# EAGLE design tcam_mini_eth (EAGLE 7.7.0)

## Sheet 1 of 3
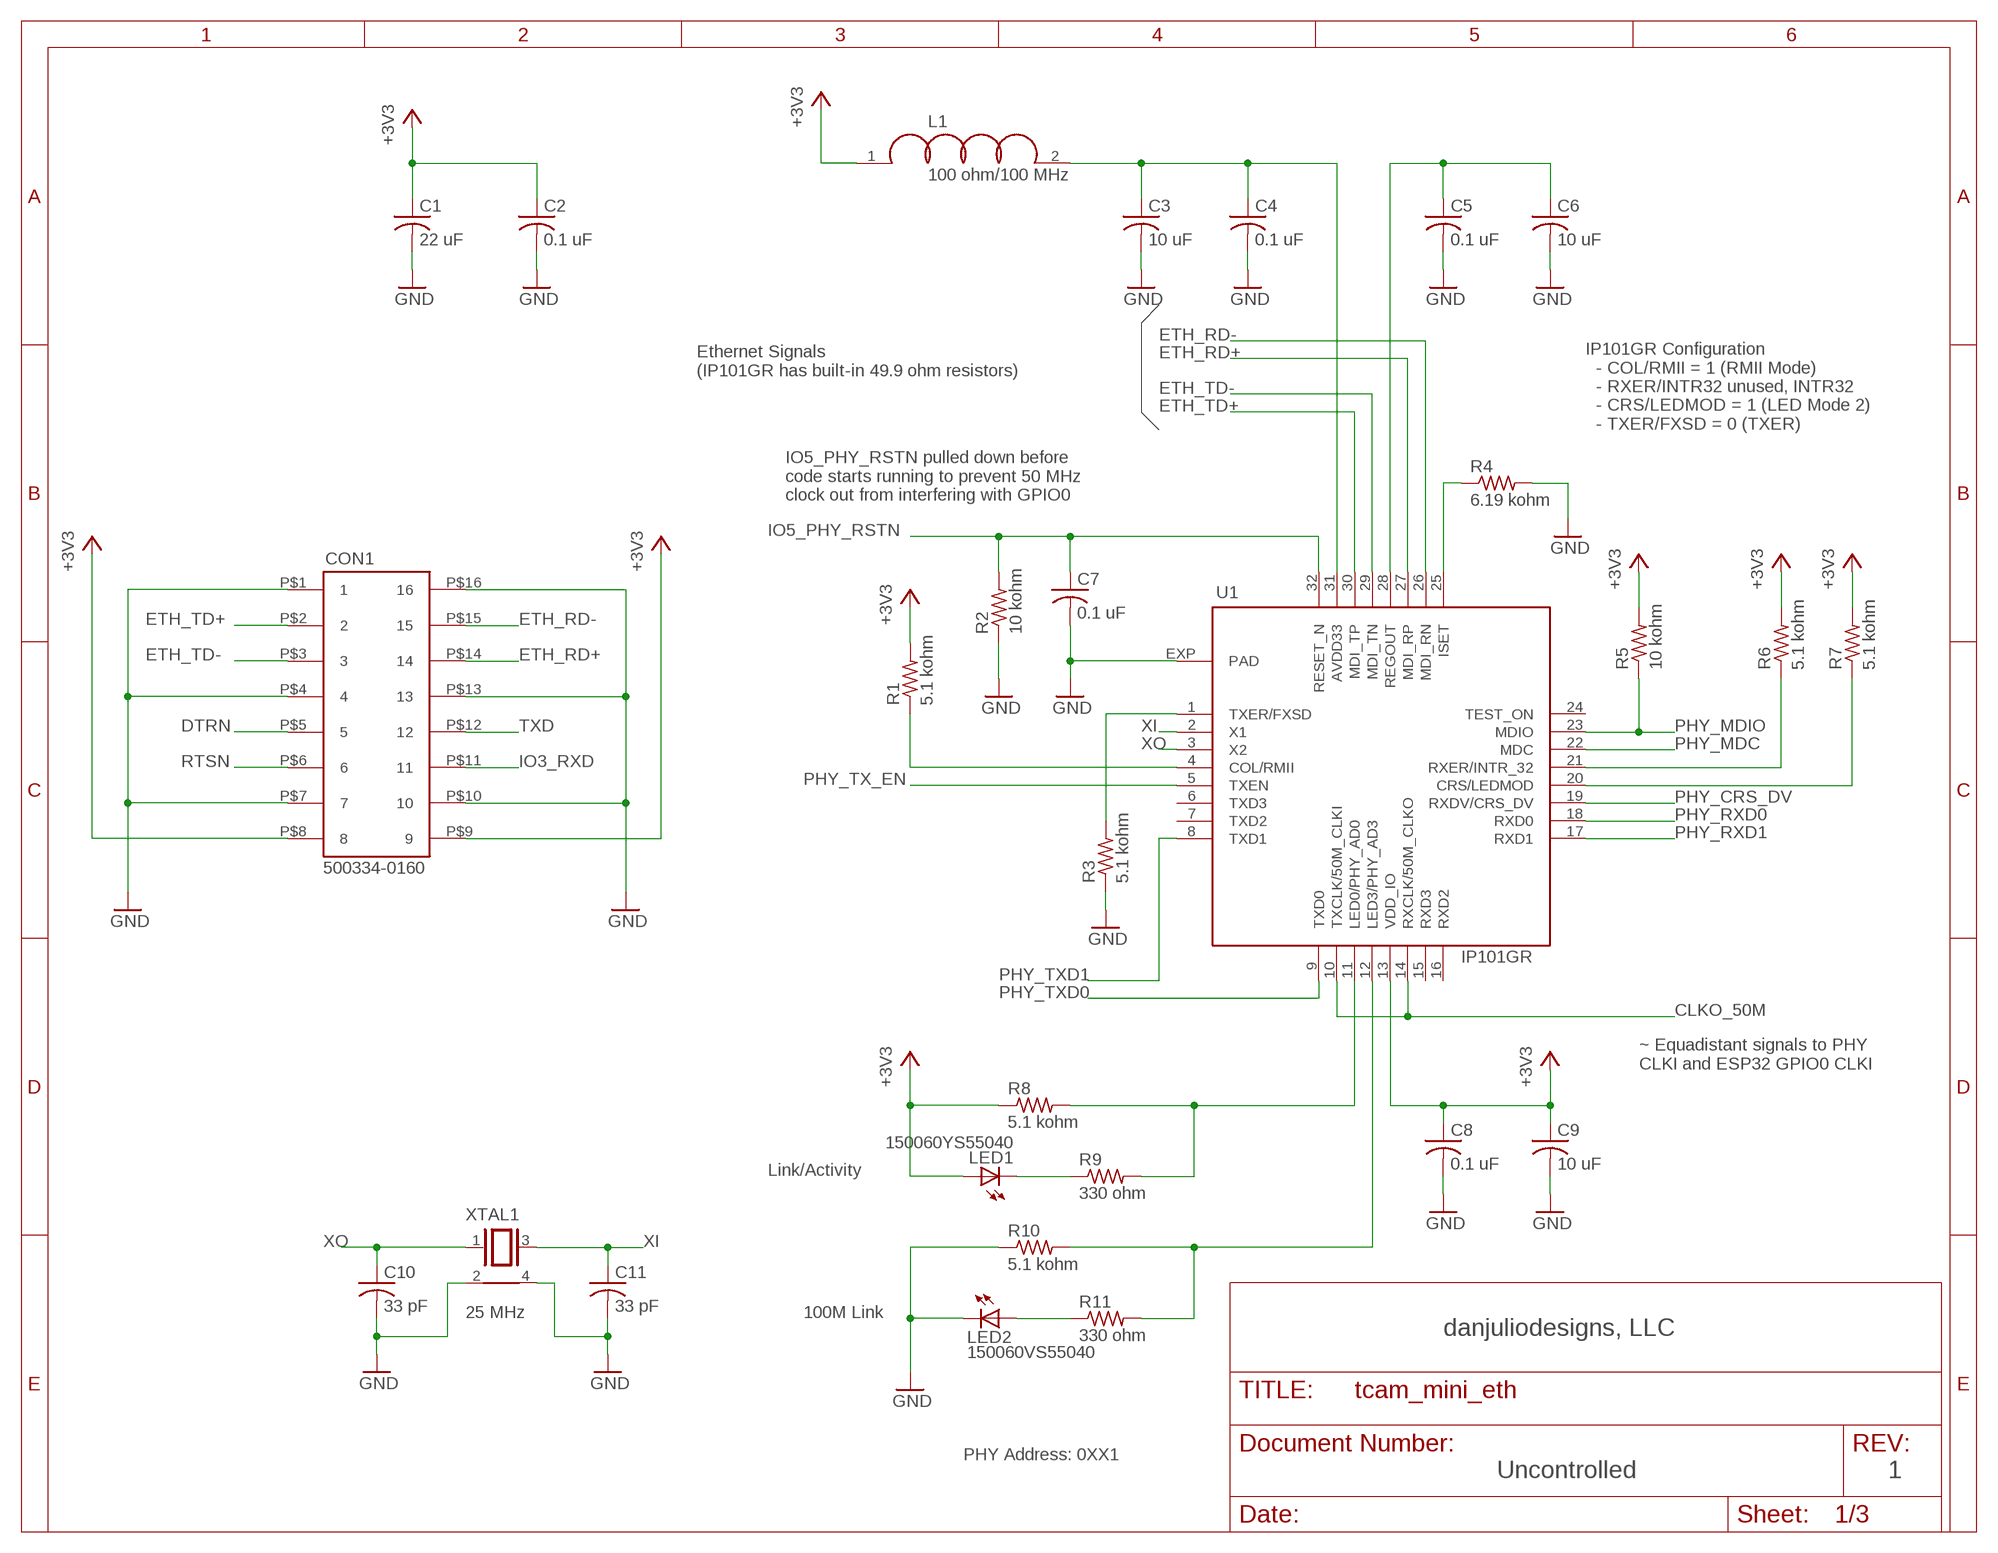
[diagram p0: schematic, sheet 1]

### Parts
C1  22 uF  C-USSMT0603  [C0603]
C2  0.1 uF  C-USSMT0402  [C0402]
C3  10 uF  C-USSMT0603  [C0603]
C4  0.1 uF  C-USSMT0402  [C0402]
C5  0.1 uF  C-USSMT0402  [C0402]
C6  10 uF  C-USSMT0603  [C0603]
C7  0.1 uF  C-USSMT0402  [C0402]
C8  0.1 uF  C-USSMT0402  [C0402]
C9  10 uF  C-USSMT0603  [C0603]
C10  33 pF  C-USSMT0402  [C0402]
C11  33 pF  C-USSMT0402  [C0402]
CON1  500334-0160  MOLEX_500334_160  [MOLEX_500334_0160]
L1  100 ohm/100 MHz  INDUCTORSMT0603  [L0603]
LED1  150060YS55040  LEDCHIPLED_0603  [CHIPLED_0603]
LED2  150060VS55040  LEDCHIPLED_0603  [CHIPLED_0603]
R1  5.1 kohm  R-USSMT0402  [R0402]
R2  10 kohm  R-USSMT0402  [R0402]
R3  5.1 kohm  R-USSMT0402  [R0402]
R4  6.19 kohm  R-USSMT0402  [R0402]
R5  10 kohm  R-USSMT0402  [R0402]
R6  5.1 kohm  R-USSMT0402  [R0402]
R7  5.1 kohm  R-USSMT0402  [R0402]
R8  5.1 kohm  R-USSMT0402  [R0402]
R9  330 ohm  R-USSMT0402  [R0402]
R10  5.1 kohm  R-USSMT0402  [R0402]
R11  330 ohm  R-USSMT0402  [R0402]
U1  IP101GR  [QFN32_4X4]
XTAL1  25 MHz  CRYSTAL5X3SMT3225  [CRYSTAL-3225]

### Nets
+3V3: C1.1 C2.1 C8.1 C9.1 CON1.P$8 CON1.P$9 L1.1 LED1.A R1.2 R5.2 R6.2 R7.2 R8.1 U1.13(VDD_IO) ; also sheet 2,3
CLKO_50M: U1.10(TXCLK/50M_CLKI) U1.14(RXCLK/50M_CLKO) ; also sheet 2
DTRN: CON1.P$5 ; also sheet 2
ETH_RD+: CON1.P$14 U1.27(MDI_RP)
ETH_RD-: CON1.P$15 U1.26(MDI_RN)
ETH_TD+: CON1.P$2 U1.30(MDI_TP)
ETH_TD-: CON1.P$3 U1.29(MDI_TN)
GND: C1.2 C2.2 C3.2 C4.2 C5.2 C6.2 C7.2 C8.2 C9.2 C10.2 C11.2 CON1.P$1 CON1.P$4 CON1.P$7 CON1.P$10 CON1.P$13 CON1.P$16 LED2.C R2.1 R3.1 R4.2 R10.1 U1.EXP(PAD) XTAL1.2 XTAL1.4 ; also sheet 2,3
IO3_RXD: CON1.P$11 ; also sheet 2
IO5_PHY_RSTN: C7.1 R2.2 U1.32(RESET_N) ; also sheet 2
N$1: C3.1 C4.1 L1.2 U1.31(AVDD33)
N$2: R4.1 U1.25(ISET)
N$3: R6.1 U1.21(RXER/INTR_32)
N$4: R1.1 U1.4(COL/RMII)
N$5: R3.2 U1.1(TXER/FXSD)
N$6: R7.1 U1.20(CRS/LEDMOD)
N$7: R8.2 R9.2 U1.11(LED0/PHY_AD0)
N$8: R10.2 R11.2 U1.12(LED3/PHY_AD3)
N$9: LED2.A R11.1
N$10: LED1.C R9.1
PHY_CRS_DV: U1.19(RXDV/CRS_DV) ; also sheet 2
PHY_MDC: U1.22(MDC) ; also sheet 2
PHY_MDIO: R5.1 U1.23(MDIO) ; also sheet 2
PHY_RXD0: U1.18(RXD0) ; also sheet 2
PHY_RXD1: U1.17(RXD1) ; also sheet 2
PHY_TX_EN: U1.5(TXEN) ; also sheet 2
PHY_TXD0: U1.9(TXD0) ; also sheet 2
PHY_TXD1: U1.8(TXD1) ; also sheet 2
REGOUT: C5.1 C6.1 U1.28(REGOUT)
RTSN: CON1.P$6 ; also sheet 2
TXD: CON1.P$12 ; also sheet 2
XI: C11.1 U1.2(X1) XTAL1.3
XO: C10.1 U1.3(X2) XTAL1.1
Unconnected: U1.6(TXD3) U1.7(TXD2) U1.15(RXD3) U1.16(RXD2) U1.24(TEST_ON)

### Notes on the sheet
- Ethernet Signals
  (IP101GR has built-in 49.9 ohm resistors)
- IP101GR Configuration
    - COL/RMII = 1 (RMII Mode)
    - RXER/INTR32 unused, INTR32
    - CRS/LEDMOD = 1 (LED Mode 2)
    - TXER/FXSD = 0 (TXER)
- IO5_PHY_RSTN pulled down before
  code starts running to prevent 50 MHz
  clock out from interfering with GPIO0
- ~ Equadistant signals to PHY
  CLKI and ESP32 GPIO0 CLKI
- Link/Activity
- 100M Link
- danjuliodesigns, LLC
- PHY Address: 0XX1
- Uncontrolled | 1

## Sheet 2 of 3
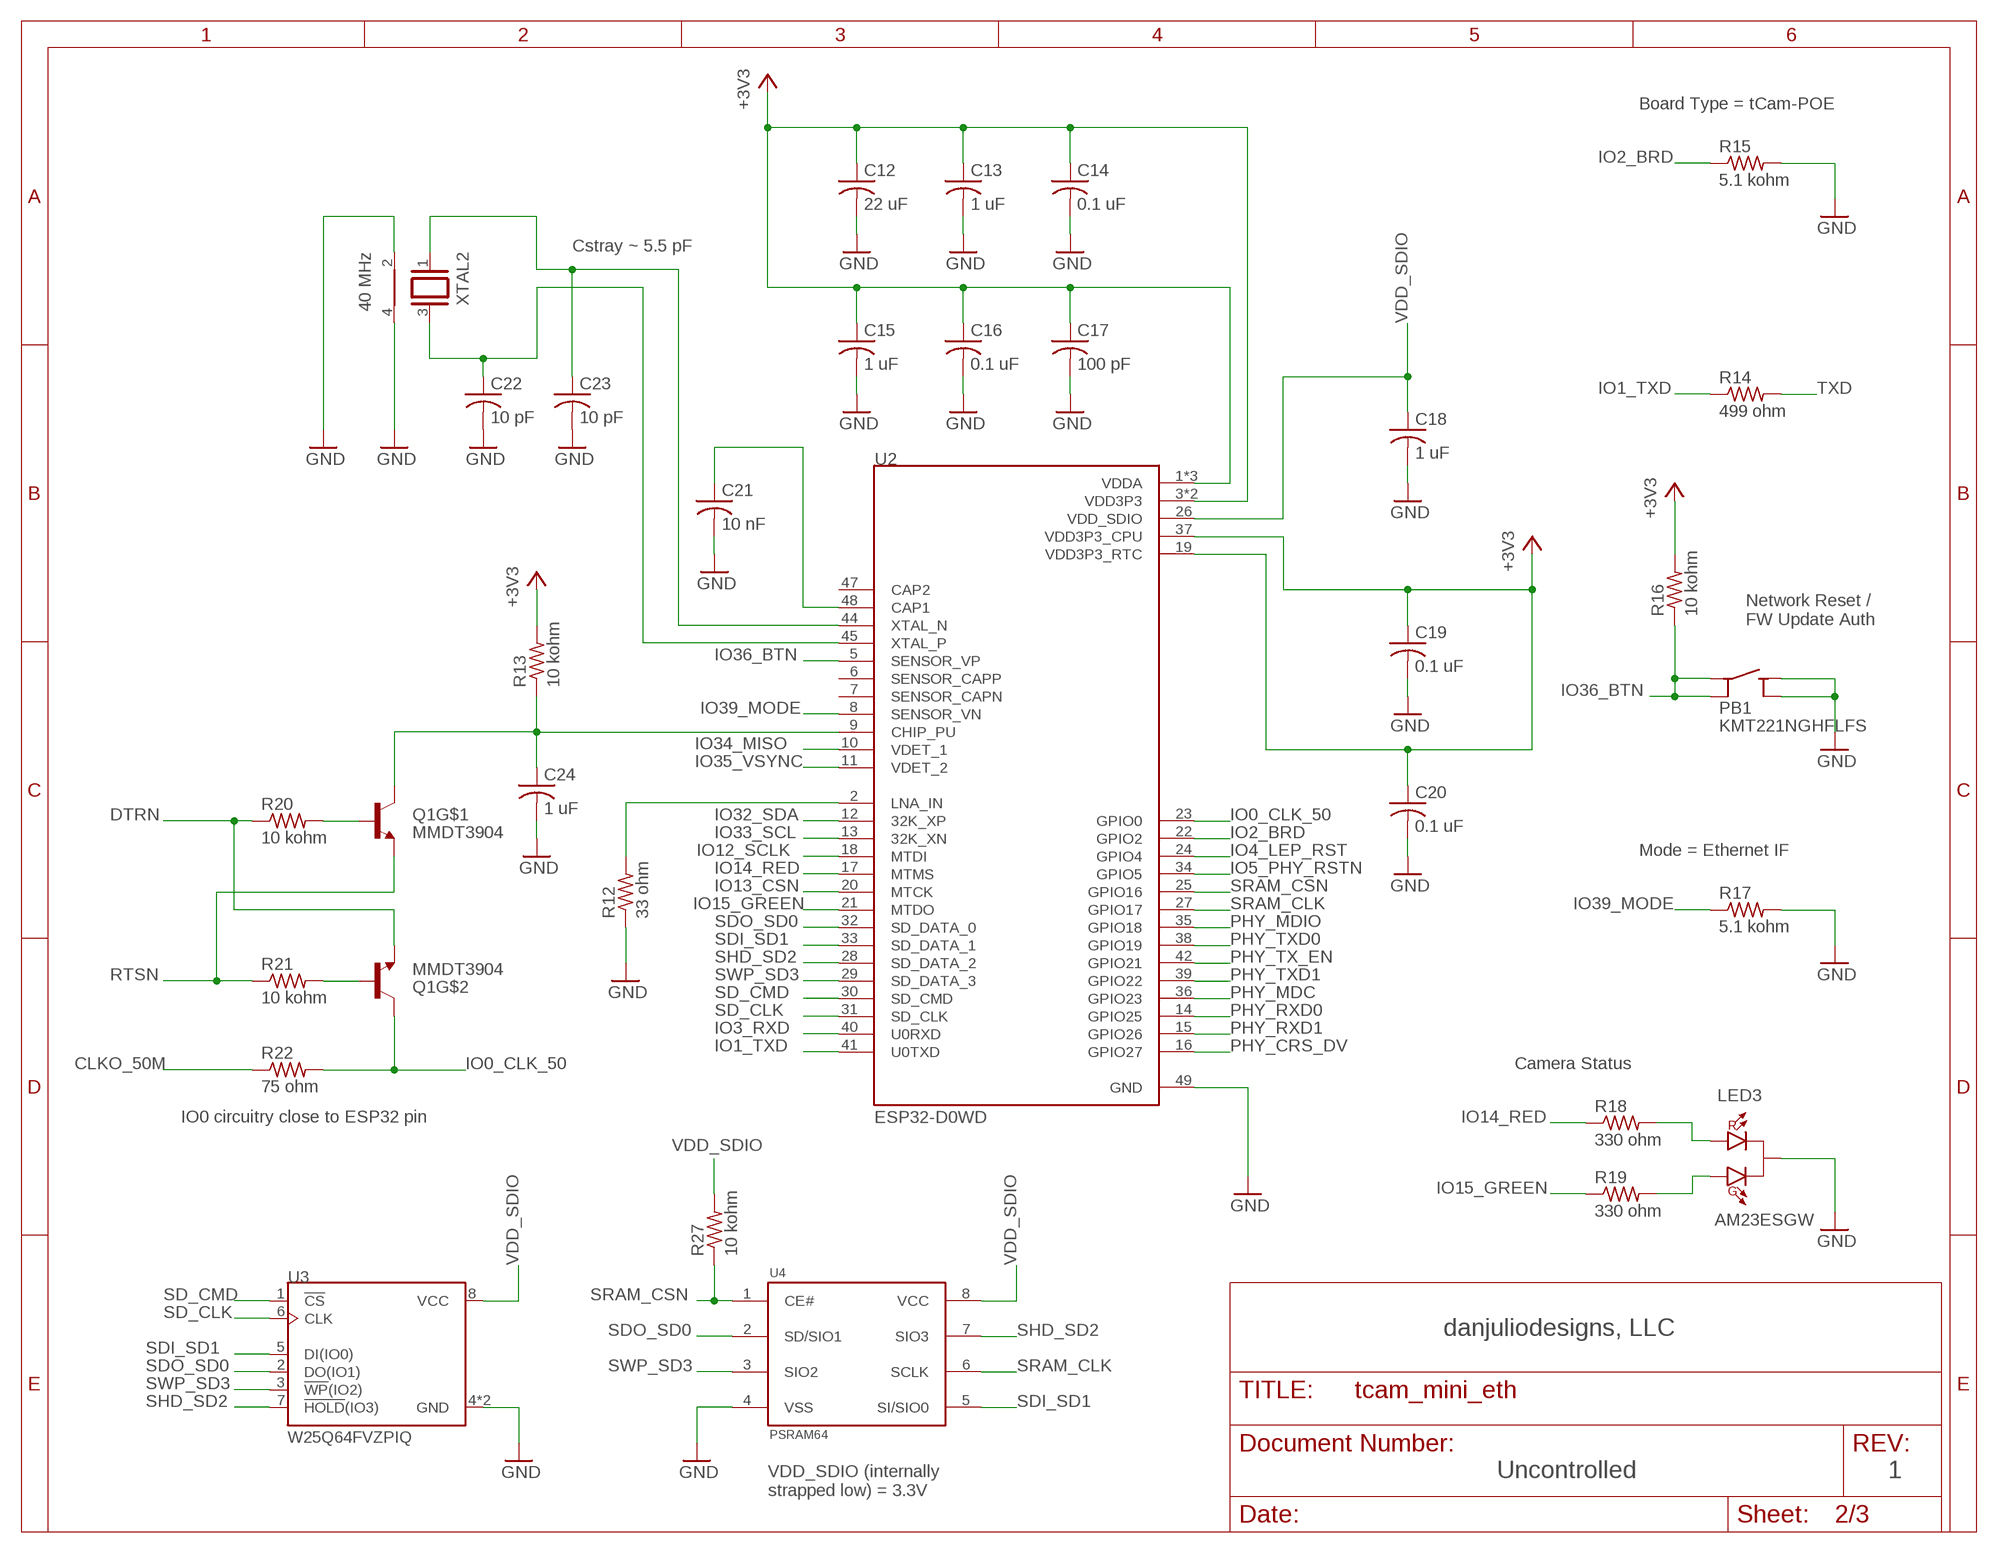
[diagram p1: schematic, sheet 2]

### Parts
C12  22 uF  C-USSMT0603  [C0603]
C13  1 uF  C-USSMT0402  [C0402]
C14  0.1 uF  C-USSMT0402  [C0402]
C15  1 uF  C-USSMT0402  [C0402]
C16  0.1 uF  C-USSMT0402  [C0402]
C17  100 pF  C-USSMT0402  [C0402]
C18  1 uF  C-USSMT0402  [C0402]
C19  0.1 uF  C-USSMT0402  [C0402]
C20  0.1 uF  C-USSMT0402  [C0402]
C21  10 nF  C-USSMT0402  [C0402]
C22  10 pF  C-USSMT0402  [C0402]
C23  10 pF  C-USSMT0402  [C0402]
C24  1 uF  C-USSMT0402  [C0402]
LED3  AM23ESGW  [SOT23-3]
PB1  KMT221NGHFLFS  CK_KMT2  [CK_KMT2]
Q1  MMDT3904  [SOT363]
R12  33 ohm  R-USSMT0603  [R0603]
R13  10 kohm  R-USSMT0402  [R0402]
R14  499 ohm  R-USSMT0402  [R0402]
R15  5.1 kohm  R-USSMT0402  [R0402]
R16  10 kohm  R-USSMT0402  [R0402]
R17  5.1 kohm  R-USSMT0402  [R0402]
R18  330 ohm  R-USSMT0402  [R0402]
R19  330 ohm  R-USSMT0402  [R0402]
R20  10 kohm  R-USSMT0402  [R0402]
R21  10 kohm  R-USSMT0402  [R0402]
R22  75 ohm  R-USSMT0402  [R0402]
R27  10 kohm  R-USSMT0402  [R0402]
U2  ESP32-D0WD  [QFN35P500X500X90-49N]
U3  W25Q64FVZPIQ  [SON127P600X500X80-9N]
U4  PSRAM64  ESP-PSRAM64  [SO8]
XTAL2  40 MHz  CRYSTAL5X3SMT3225  [CRYSTAL-3225]

### Nets
+3V3: C12.1 C13.1 C14.1 C15.1 C16.1 C17.1 C19.1 C20.1 R13.2 R16.2 U2.1(VDDA) U2.3(VDD3P3) U2.4(VDD3P3) U2.19(VDD3P3_RTC) U2.37(VDD3P3_CPU) U2.43(VDDA) U2.46(VDDA) ; also sheet 1,3
CLKO_50M: R22.1 ; also sheet 1
DTRN: Q1.1(E) R20.1 ; also sheet 1
GND: C12.2 C13.2 C14.2 C15.2 C16.2 C17.2 C18.2 C19.2 C20.2 C21.2 C22.2 C23.2 C24.2 LED3.3(C) PB1.3 PB1.4 R12.1 R15.2 R17.2 U2.49(GND) U3.4(GND) U3.9(GND) U4.4(VSS) XTAL2.2 XTAL2.4 ; also sheet 1,3
IO0_CLK_50: Q1.6(C) R22.2 U2.23(GPIO0)
IO1_TXD: R14.1 U2.41(U0TXD)
IO2_BRD: R15.1 U2.22(GPIO2)
IO3_RXD: U2.40(U0RXD) ; also sheet 1
IO4_LEP_RST: U2.24(GPIO4) ; also sheet 3
IO5_PHY_RSTN: U2.34(GPIO5) ; also sheet 1
IO12_SCLK: U2.18(MTDI) ; also sheet 3
IO13_CSN: U2.20(MTCK) ; also sheet 3
IO14_RED: R18.1 U2.17(MTMS)
IO15_GREEN: R19.1 U2.21(MTDO)
IO32_SDA: U2.12(32K_XP) ; also sheet 3
IO33_SCL: U2.13(32K_XN) ; also sheet 3
IO34_MISO: U2.10(VDET_1) ; also sheet 3
IO35_VSYNC: U2.11(VDET_2) ; also sheet 3
IO36_BTN: PB1.1 PB1.2 R16.1 U2.5(SENSOR_VP)
IO39_MODE: R17.1 U2.8(SENSOR_VN)
N$11: C23.1 U2.44(XTAL_N) XTAL2.1
N$12: C22.1 U2.45(XTAL_P) XTAL2.3
N$13: LED3.1(RA) R18.2
N$14: C24.1 Q1.3(C) R13.1 U2.9(CHIP_PU)
N$15: R12.2 U2.2(LNA_IN)
N$16: C21.1 U2.48(CAP1)
N$17: LED3.2(GA) R19.2
N$18: Q1.2(B) R21.2
N$21: Q1.5(B) R20.2
PHY_CRS_DV: U2.16(GPIO27) ; also sheet 1
PHY_MDC: U2.36(GPIO23) ; also sheet 1
PHY_MDIO: U2.35(GPIO18) ; also sheet 1
PHY_RXD0: U2.14(GPIO25) ; also sheet 1
PHY_RXD1: U2.15(GPIO26) ; also sheet 1
PHY_TX_EN: U2.42(GPIO21) ; also sheet 1
PHY_TXD0: U2.38(GPIO19) ; also sheet 1
PHY_TXD1: U2.39(GPIO22) ; also sheet 1
RTSN: Q1.4(E) R21.1 ; also sheet 1
SD_CLK: U2.31(SD_CLK) U3.6(CLK)
SD_CMD: U2.30(SD_CMD) U3.1(!CS)
SDI_SD1: U2.33(SD_DATA_1) U3.5(DI(IO0)) U4.5(SI/SIO0)
SDO_SD0: U2.32(SD_DATA_0) U3.2(DO(IO1)) U4.2(SD/SIO1)
SHD_SD2: U2.28(SD_DATA_2) U3.7(!HOLD!(IO3)) U4.7(SIO3)
SRAM_CLK: U2.27(GPIO17) U4.6(SCLK)
SRAM_CSN: R27.1 U2.25(GPIO16) U4.1(CE#)
SWP_SD3: U2.29(SD_DATA_3) U3.3(!WP!(IO2)) U4.3(SIO2)
TXD: R14.2 ; also sheet 1
VDD_SDIO: C18.1 R27.2 U2.26(VDD_SDIO) U3.8(VCC) U4.8(VCC)
Unconnected: U2.6(SENSOR_CAPP) U2.7(SENSOR_CAPN) U2.47(CAP2)

### Notes on the sheet
- Board Type = tCam-POE
- Cstray ~ 5.5 pF
- Network Reset /
  FW Update Auth
- Mode = Ethernet IF
- Camera Status
- IO0 circuitry close to ESP32 pin
- danjuliodesigns, LLC
- Uncontrolled | 1
- VDD_SDIO (internally
  strapped low) = 3.3V

## Sheet 3 of 3
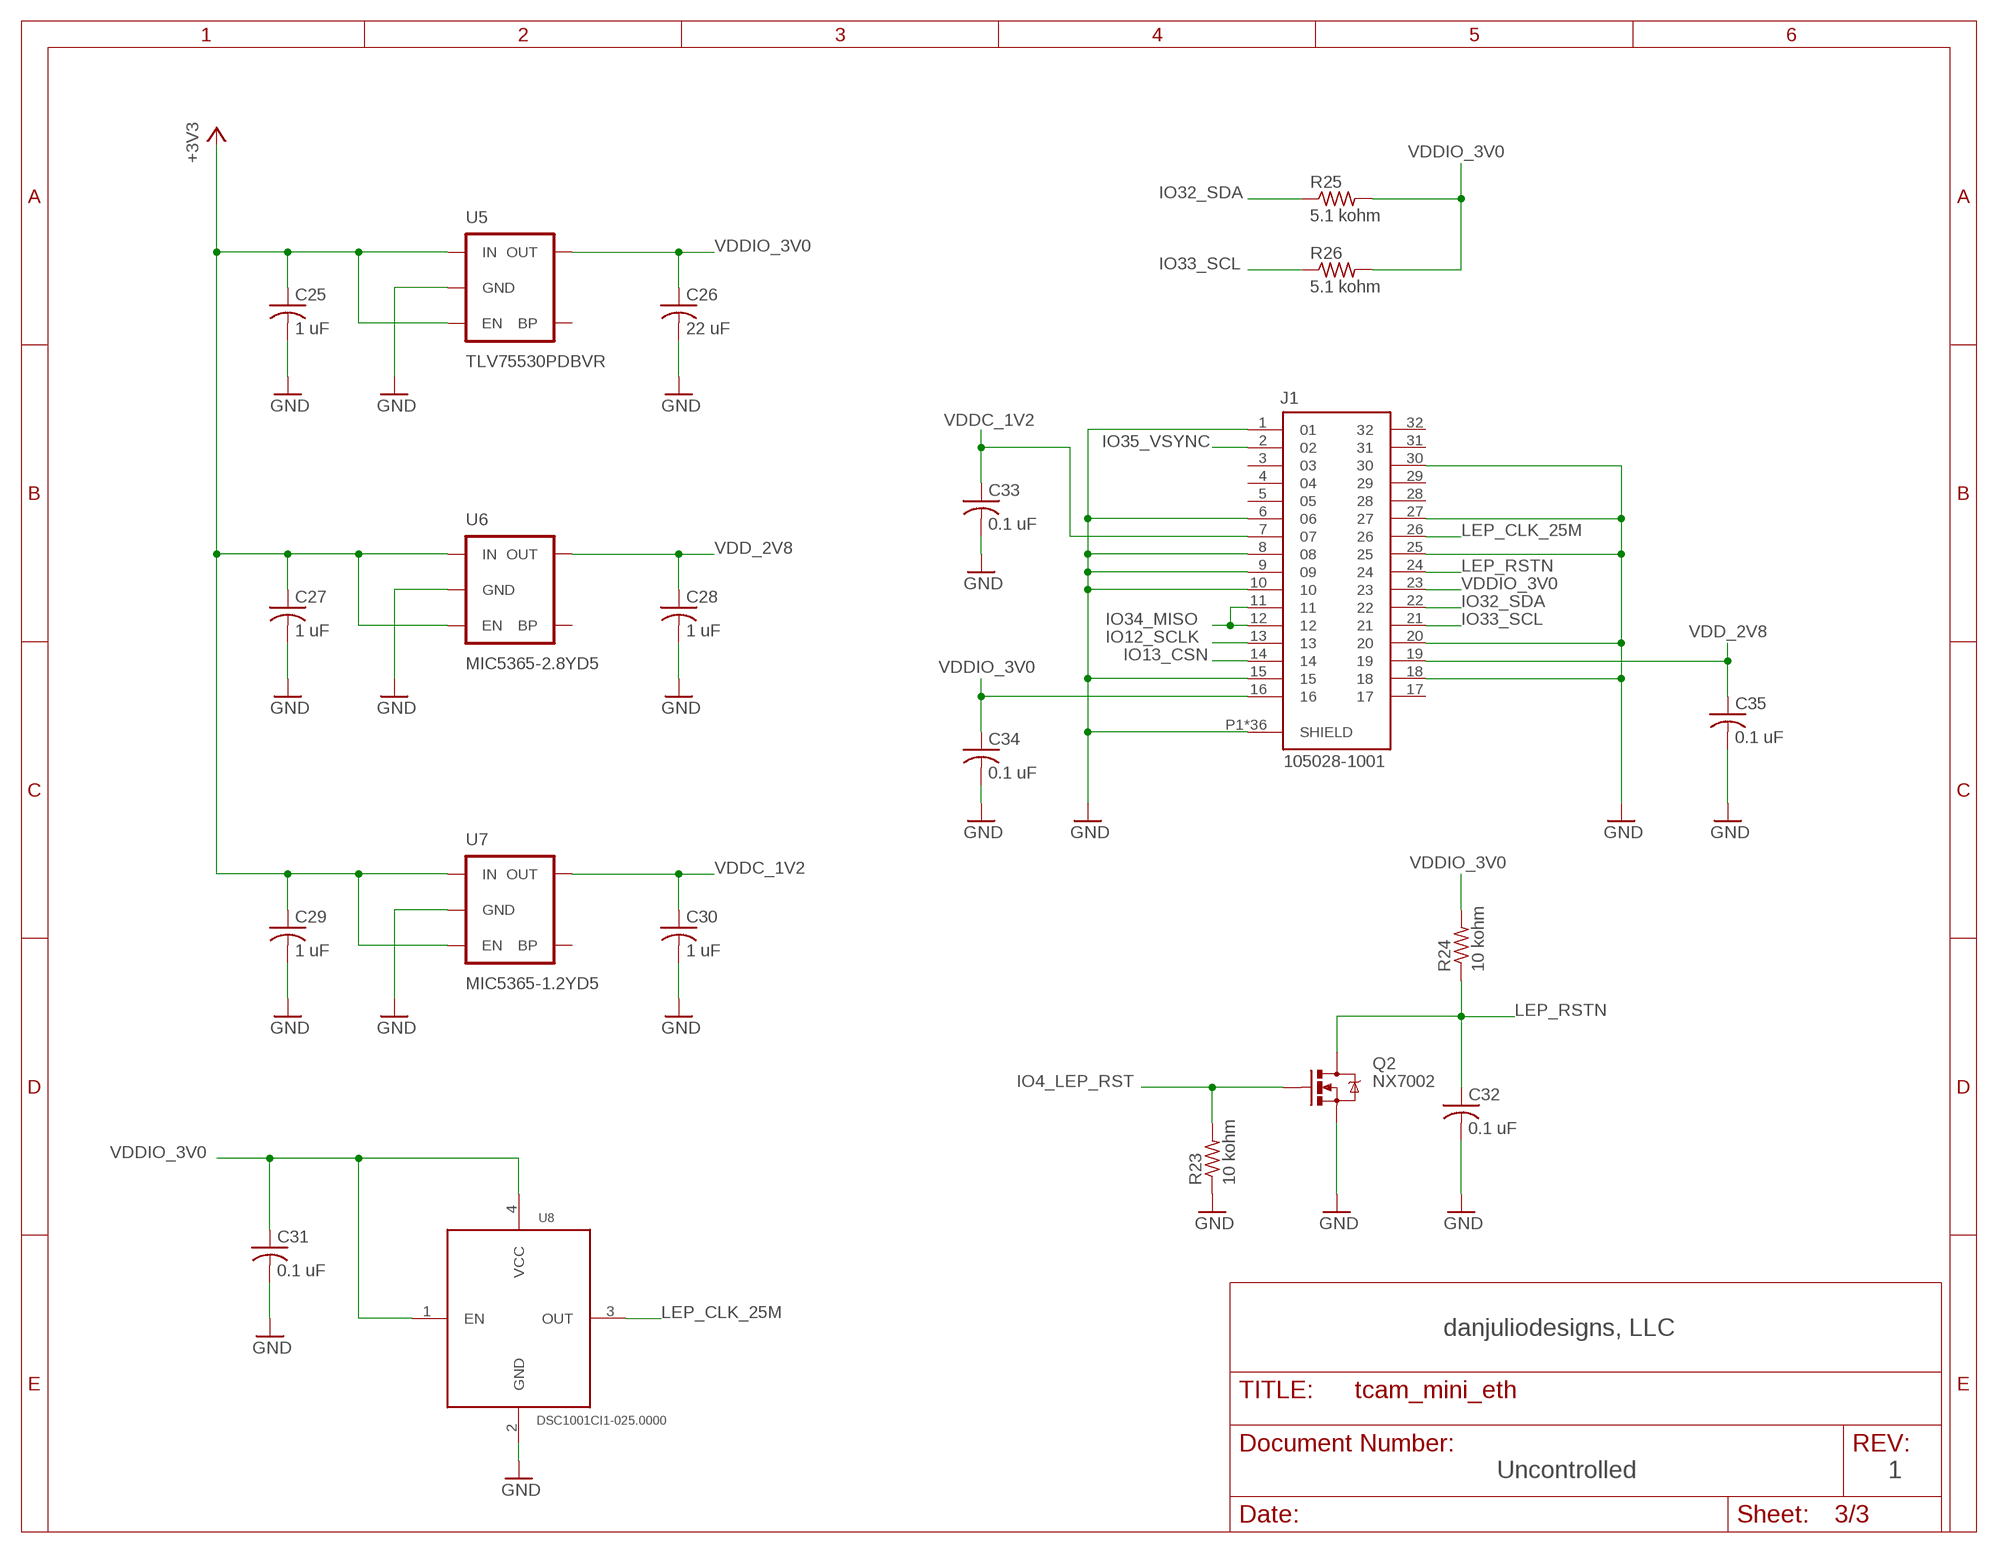
[diagram p2: schematic, sheet 3]

### Parts
C25  1 uF  C-USSMT0402  [C0402]
C26  22 uF  C-USSMT0603  [C0603]
C27  1 uF  C-USSMT0402  [C0402]
C28  1 uF  C-USSMT0402  [C0402]
C29  1 uF  C-USSMT0402  [C0402]
C30  1 uF  C-USSMT0402  [C0402]
C31  0.1 uF  C-USSMT0402  [C0402]
C32  0.1 uF  C-USSMT0402  [C0402]
C33  0.1 uF  C-USSMT0402  [C0402]
C34  0.1 uF  C-USSMT0402  [C0402]
C35  0.1 uF  C-USSMT0402  [C0402]
J1  105028-1001  [MOLEX_105028-1001]
Q2  NX7002  MOSFET-NCHANNELSOT23  [SOT23-3]
R23  10 kohm  R-USSMT0402  [R0402]
R24  10 kohm  R-USSMT0402  [R0402]
R25  5.1 kohm  R-USSMT0402  [R0402]
R26  5.1 kohm  R-USSMT0402  [R0402]
U5  TLV75530PDBVR  V_REG_LDO  [SOT23-5]
U6  MIC5365-2.8YD5  V_REG_LDO  [SOT23-5]
U7  MIC5365-1.2YD5  V_REG_LDO  [SOT23-5]
U8  DSC1001CI1-025.0000  OSC_EN3225  [CRYSTAL-3225]

### Nets
+3V3: C25.1 C27.1 C29.1 U5.1(IN) U5.3(EN) U6.1(IN) U6.3(EN) U7.1(IN) U7.3(EN) ; also sheet 1,2
GND: C25.2 C26.2 C27.2 C28.2 C29.2 C30.2 C31.2 C32.2 C33.2 C34.2 C35.2 J1.1 J1.6 J1.8 J1.9 J1.10 J1.15 J1.18 J1.20 J1.25 J1.27 J1.30 J1.P1(SHIELD) J1.P2(SHIELD) J1.P3(SHIELD) J1.P4(SHIELD) J1.P5(SHIELD) J1.P6(SHIELD) J1.P7(SHIELD) J1.P8(SHIELD) J1.P9(SHIELD) J1.P10(SHIELD) J1.P11(SHIELD) J1.P12(SHIELD) J1.P13(SHIELD) J1.P14(SHIELD) J1.P15(SHIELD) J1.P16(SHIELD) J1.P17(SHIELD) J1.P18(SHIELD) J1.P19(SHIELD) J1.P20(SHIELD) J1.P21(SHIELD) J1.P22(SHIELD) J1.P23(SHIELD) J1.P24(SHIELD) J1.P25(SHIELD) J1.P26(SHIELD) J1.P27(SHIELD) J1.P28(SHIELD) J1.P29(SHIELD) J1.P30(SHIELD) J1.P31(SHIELD) J1.P32(SHIELD) J1.P33(SHIELD) J1.P34(SHIELD) J1.P35(SHIELD) J1.P36(SHIELD) Q2.2(S) R23.1 U5.2(GND) U6.2(GND) U7.2(GND) U8.2(GND) ; also sheet 1,2
IO4_LEP_RST: Q2.1(G) R23.2 ; also sheet 2
IO12_SCLK: J1.13 ; also sheet 2
IO13_CSN: J1.14 ; also sheet 2
IO32_SDA: J1.22 R25.1 ; also sheet 2
IO33_SCL: J1.21 R26.1 ; also sheet 2
IO34_MISO: J1.11 J1.12 ; also sheet 2
IO35_VSYNC: J1.2 ; also sheet 2
LEP_CLK_25M: J1.26 U8.3(OUT)
LEP_RSTN: C32.1 J1.24 Q2.3(D) R24.1
VDD_2V8: C28.1 C35.1 J1.19 U6.5(OUT)
VDDC_1V2: C30.1 C33.1 J1.7 U7.5(OUT)
VDDIO_3V0: C26.1 C31.1 C34.1 J1.16 J1.23 R24.2 R25.2 R26.2 U5.5(OUT) U8.1(EN) U8.4(VCC)
Unconnected: J1.3 J1.4 J1.5 J1.17 J1.28 J1.29 J1.31 J1.32 U5.4(BP) U6.4(BP) U7.4(BP)

### Notes on the sheet
- danjuliodesigns, LLC
- Uncontrolled | 1

## Library data of the parts
C1-C35 = djd_eagle_library:C-US
CON1 = djd_eagle_library:MOLEX_500334_160: Molex 500334-0160 0.5 mm 2 row 16 circuit board-to-board receptacle
J1 = 105028-1001:105028-1001: 32 (4 x 8) Pos Camera Socket Socket Gold Surface Mount Check prices <https://pricing.snapeda.com/parts/1050281001/Molex/view-part?ref=eda>; AVAILABILITY: Good; DESCRIPTION: 32 (4 x 8) Pos Camera Socket Socket Gold Surface Mount; MF: Molex; MP: 1050281001; PACKAGE: None; PRICE: None; PURCHASE-URL: https://pricing.snapeda.com/search/part/1050281001/?ref=eda
L1 = djd_eagle_library:INDUCTOR
LED1 LED2 = led:LED: LED OSRAM: - CHIPLED LG R971, LG N971, LY N971, LG Q971, LY Q971, LO R971, LY R971 LH N974, LH R974 LS Q976, LO Q976, LY Q976 LO Q996 - Hyper CHIPLED LW Q18S LB Q993, LB Q99A, LB R99A - SideLED LS A670, LO A670, LY A670, LG A670, LP A670 LB A673, LV A673, LT A673, LW A673 LH A674 LY A675 LS A676, LA A676, LO A676, LY A676, LW A676 LS A679, LY A679, LG A679 - Hyper Micro SIDELED® LS Y876, LA Y876, LO Y876, LY Y876 LT Y87S - SmartLED LW L88C, LW L88S LB L89C, LB L89S, LG L890 LS L89K, LO L89K, LY L89K LS L896, LA L896, LO L896, LY L896 - TOPLED LS T670, LO T670, LY T670, LG T670, LP T670 LSG T670, LSP T670, LSY T670, LOP T670, LYG T670 LG T671, LOG T671, LSG T671 LB T673, LV T673, LT T673, LW T673 LH T674 LS T676, LA T676, LO T676, LY T676, LB T676, LH T676, LSB T676, LW T676 LB T67C, LV T67C, LT T67C, LS T67K, LO T67K, LY T67K, LW E67C LS E67B, LA E67B, LO E67B, LY E67B, LB E67C, LV E67C, LT E67C LW T67C LS T679, LY T679, LG T679 LS T770, LO T770, LY T770, LG T770, LP T770 LB T773, LV T773, LT T773, LW T773 LH T774 LS E675, LA E675, LY E675, LS T675 LS T776, LA T776, LO T776, LY T776, LB T776 LHGB T686 LT T68C, LB T68C - Hyper Mini TOPLED® LB M676 - Mini TOPLED Santana® LG M470 LS M47K, LO M47K, LY M47K Source: http://www.osram.convergy.de LUXEON: - LUMILED® LXK2-PW12-R00, LXK2-PW12-S00, LXK2-PW14-U00, LXK2-PW14-V00 LXK2-PM12-R00, LXK2-PM12-S00, LXK2-PM14-U00 LXK2-PE12-Q00, LXK2-PE12-R00, LXK2-PE12-S00, LXK2-PE14-T00, LXK2-PE14-U00 LXK2-PB12-K00, LXK2-PB12-L00, LXK2-PB12-M00, LXK2-PB14-N00, LXK2-PB14-P00, LXK2-PB14-Q00 LXK2-PR12-L00, LXK2-PR12-M00, LXK2-PR14-Q00, LXK2-PR14-R00 LXK2-PD12-Q00, LXK2-PD12-R00, LXK2-PD12-S00 LXK2-PH12-R00, LXK2-PH12-S00 LXK2-PL12-P00, LXK2-PL12-Q00, LXK2-PL12-R00 Source: www.luxeon.com KINGBRIGHT: KA-3528ASYC Source: www.kingbright.com
LED3 = djd_eagle_library:AM23ESGW: Kingbright SOT-23 Surface Mount Red/Green LED Lamp
PB1 = djd_eagle_library:CK_KMT2
Q1 = SparkFun-DiscreteSemi:MMDT3904: Dual NPN transistor
Q2 = djd_eagle_library:MOSFET-NCHANNEL
R1-R27 = djd_eagle_library:R-US
U1 = IP101GR:IP101GR: Single Port 10/100 MII/RMII/TP/Fiber Fast Ethernet Transceiver; AVAILABILITY: Not in stock; DESCRIPTION: Ethernet ICs; MF: WIZnet; MP: IP101GR; PACKAGE: None; PRICE: None
U2 = ESP32-D0WD:ESP32-D0WD: ESP32 is a single 2.4 GHz Wi-Fi-and-Bluetooth combo chip designed with the TSMC ultra-low-power 40 nm technology. It is designed to achieve the best power and RF performance, showing robustness, versatility and reliability in a wide variety of applications and power scenarios. Check availability <https://pricing.snapeda.com/parts/ESP32-D0WD/Espressif%20Systems/view-part?ref=eda>; AVAILABILITY: In Stock; CHECK_PRICES: https://www.snapeda.com/parts/ESP32-D0WD/Espressif+Systems/view-part/?ref=eda; DESCRIPTION: IC RF TxRx + MCU Bluetooth, WiFi 802.11b/g/n, Bluetooth 4.2 2.412GHz ~ 2.484GHz 48-VFQFN Exposed Pad; MF: Espressif Systems; MP: ESP32-D0WD; PACKAGE: VFQFN-48 Espressif Systems; PRICE: None; SNAPEDA_LINK: https://www.snapeda.com/parts/ESP32-D0WD/Espressif+Systems/view-part/?ref=snap
U3 = W25Q64FVZPIQ:W25Q64FVZPIQ: Ic Flash 64mbit 104mhz 8wson Check availability <https://pricing.snapeda.com/parts/W25Q64FVZPIQ/Winbond/view-part?ref=eda>; AVAILABILITY: In Stock; CHECK_PRICES: https://www.snapeda.com/parts/W25Q64FVZPIQ/Winbond+Electronics/view-part/?ref=eda; DESCRIPTION: FLASH - NOR Memory IC 64Mb (8M x 8) SPI - Quad I/O, QPI 104 MHz 8-WSON (6x5); MF: Winbond; MP: W25Q64FVZPIQ; PACKAGE: WSON-8 Winbond; PRICE: None; PURCHASE-URL: https://www.snapeda.com/api/url_track_click_mouser/?unipart_id=563369&manufacturer=Winbond&part_name=W25Q64FVZPIQ&search_term=w25q64; SNAPEDA_LINK: https://www.snapeda.com/parts/W25Q64FVZPIQ/Winbond+Electronics/view-part/?ref=snap
U4 = djd_eagle_library:ESP-PSRAM64: Espressif ESP-PSRAM
U5-U7 = djd_eagle_library:V_REG_LDO
U8 = djd_eagle_library:OSC_EN: Oscillator with enable
XTAL1 XTAL2 = djd_eagle_library:CRYSTAL5X3

## Board
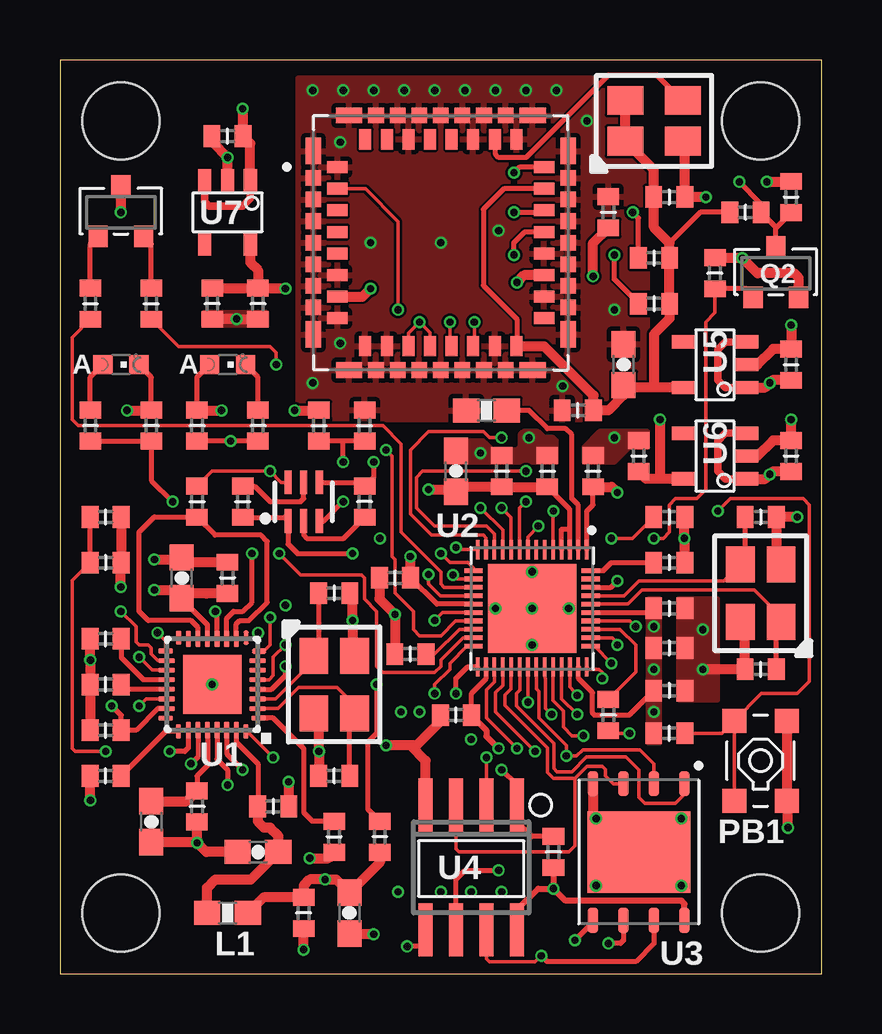
[diagram p3: board, top side]
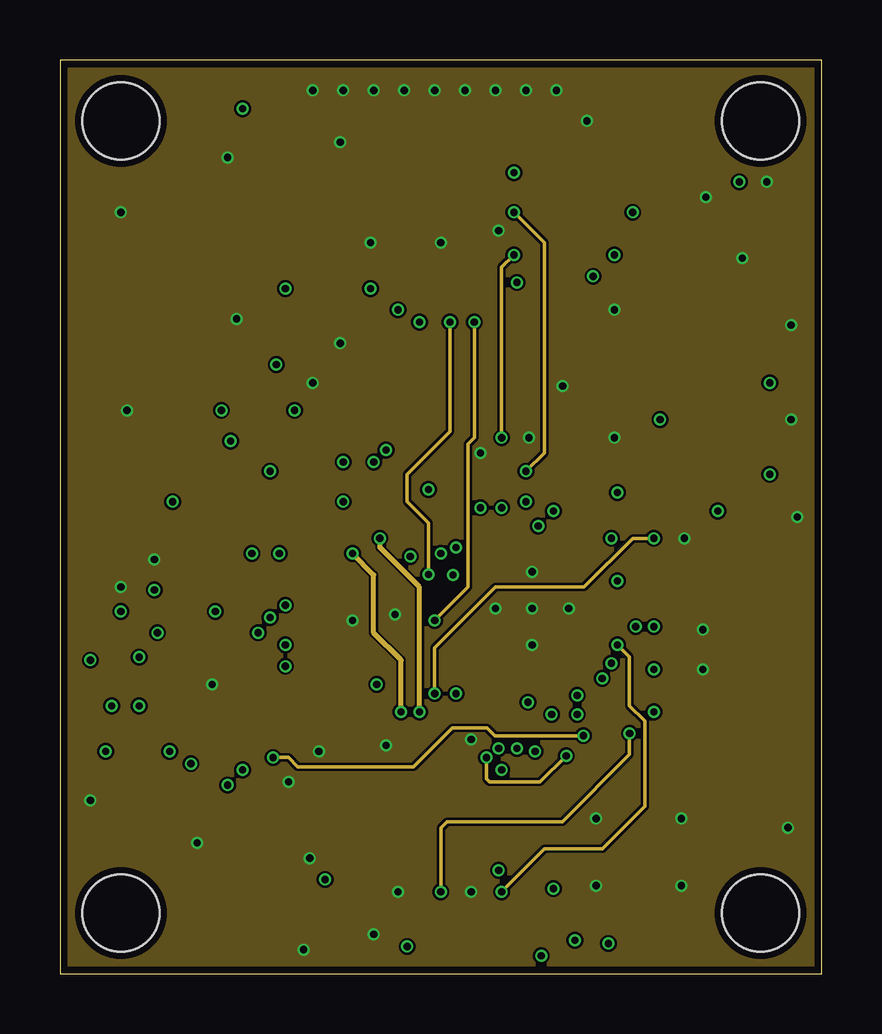
[diagram p4: board, inner layer Route2]
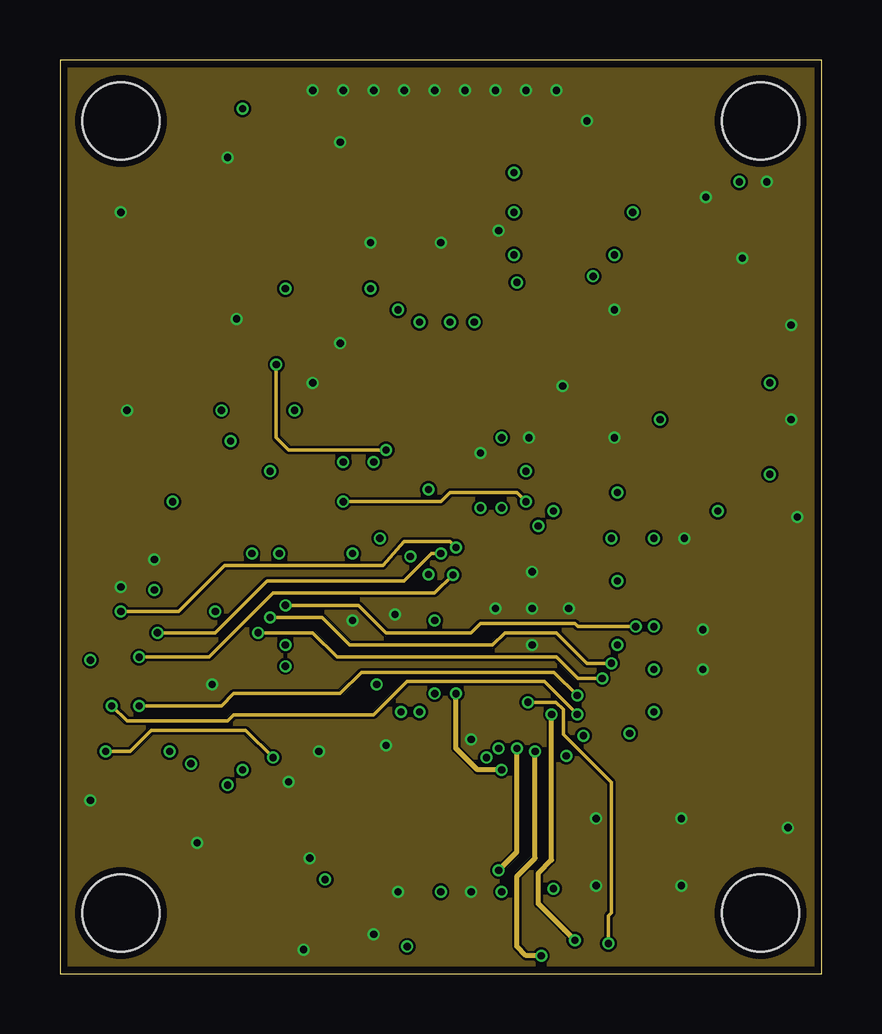
[diagram p5: board, inner layer Route15]
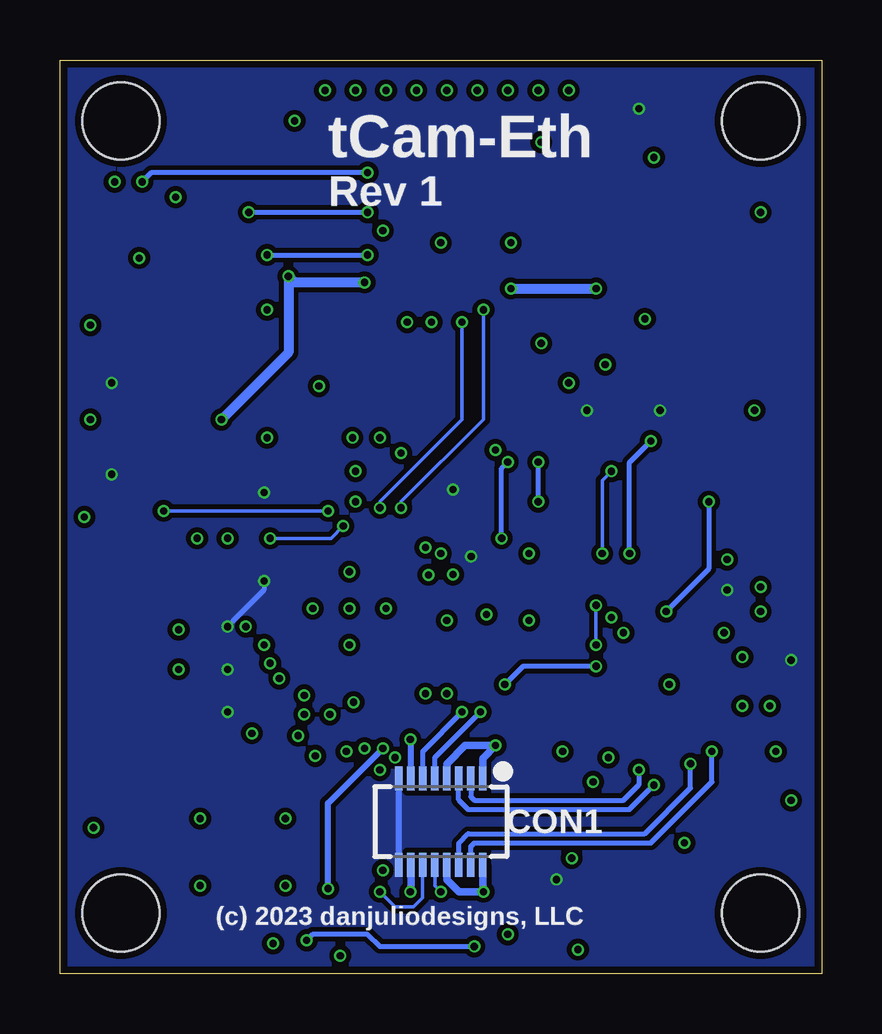
[diagram p6: board, bottom side, seen from below]

Size 31.75 x 38.1 mm. Coordinates in mm from the lower left corner, seen from the top.
Outline: 0,0 31.75,0 31.75,38.1 0,38.1 0,0
Copper layers (1+2*15+16): Top 0.035mm / dielectric 0.11mm / Route2 0.035mm / dielectric 1.2mm / Route15 0.035mm / dielectric 0.11mm / Bottom 0.035mm
Design rules "PCBWay_4L_100um-Track": minimum track width 0.1mm, minimum drill 0.3mm, track to track 0.1mm, track to pad 0.1mm, pad to pad 0.1mm, via to via 0.1mm, smd to smd 0mil, copper to edge 0.3mm, drill to drill 10mil, minimum pad ring 6mil, minimum via ring 0.1mm, stop-mask expansion 2mil, vias tented up to drill 0.45mm, thermal gap 0.2mm
Holes 3.2 mm at 2.54,2.54 2.54,35.56 29.21,2.54 29.21,35.56

### Footprints (pad centres in the part's own frame; a part is rotated, then mirrored left to right if it is on the bottom)
C0603 = smd 1.1 x 1: 1 -0.85,0; 2 0.85,0
C0402 = smd 0.7 x 0.9: 1 -0.65,0; 2 0.65,0
MOLEX_500334_0160 = smd 1 x 0.3: P$1 -1.8,1.75; P$2 -1.8,1.25; P$3 -1.8,0.75; P$4 -1.8,0.25; P$5 -1.8,-0.25; P$6 -1.8,-0.75; P$7 -1.8,-1.25; P$8 -1.8,-1.75; P$9 1.8,-1.75; P$10 1.8,-1.25; P$11 1.8,-0.75; P$12 1.8,-0.25; P$13 1.8,0.25; P$14 1.8,0.75; P$15 1.8,1.25; P$16 1.8,1.75
MOLEX_105028-1001 = smd 0.84 x 0.5: 1 -4.31,3.15; 2 -4.31,2.25; 3 -4.31,1.35; 4 -4.31,0.45; 5 -4.31,-0.45; 6 -4.31,-1.35; 7 -4.31,-2.25; 8 -4.31,-3.15; 17 4.31,-3.15; 18 4.31,-2.25; 19 4.31,-1.35; 20 4.31,-0.45; 21 4.31,0.45; 22 4.31,1.35; 23 4.31,2.25; 24 4.31,3.15 | smd 0.5 x 0.84: 9 -3.15,-4.31; 10 -2.25,-4.31; 11 -1.35,-4.31; 12 -0.45,-4.31; 13 0.45,-4.31; 14 1.35,-4.31; 15 2.25,-4.31; 16 3.15,-4.31; 25 3.15,4.31; 26 2.25,4.31; 27 1.35,4.31; 28 0.45,4.31; 29 -0.45,4.31; 30 -1.35,4.31; 31 -2.25,4.31; 32 -3.15,4.31 | smd 0.65 x 1.1: P1 -5.305,3.825; P9 -5.305,-3.825; P19 5.305,-3.825; P27 5.305,3.825 | smd 0.65 x 0.65: P2 -5.305,2.7; P3 -5.305,1.8; P4 -5.305,0.9; P5 -5.305,0; P6 -5.305,-0.9; P7 -5.305,-1.8; P8 -5.305,-2.7; P11 -2.7,-5.305; P12 -1.8,-5.305; P13 -0.9,-5.305; P14 0,-5.305; P15 0.9,-5.305; P16 1.8,-5.305; P17 2.7,-5.305; P20 5.305,-2.7; P21 5.305,-1.8; P22 5.305,-0.9; P23 5.305,0; P24 5.305,0.9; P25 5.305,1.8; P26 5.305,2.7; P29 2.7,5.305; P30 1.8,5.305; P31 0.9,5.305; P32 0,5.305; P33 -0.9,5.305; P34 -1.8,5.305; P35 -2.7,5.305 | smd 1.1 x 0.65: P10 -3.825,-5.305; P18 3.825,-5.305; P28 3.825,5.305; P36 -3.825,5.305
L0603 = smd 1.1 x 1: 1 -0.85,0; 2 0.85,0
CHIPLED_0603 = smd 0.8 x 0.8: A 0,-0.75; C 0,0.75
SOT23-3 = smd 0.8 x 0.9: 1 -0.95,-1; 2 0.95,-1; 3 0,1.1
CK_KMT2 = smd 1 x 1: 1 -1.665,1.1; 2 1.665,1.1; 3 -1.665,-1.1; 4 1.665,-1.1
SOT363 = smd 0.3 x 0.99: 1 -0.65,-0.8; 2 0,-0.8; 3 0.65,-0.8; 4 0.65,0.81; 5 0,0.81; 6 -0.65,0.81
R0402 = smd 0.7 x 0.9: 1 -0.65,0; 2 0.65,0
R0603 = smd 1.1 x 1: 1 -0.85,0; 2 0.85,0
QFN32_4X4 = smd 0.6 x 0.22: 1 -1.93,1.4; 8 -1.95,-1.39; 17 1.94,-1.4; 24 1.94,1.4 | smd 0.7 x 0.22: 2 -1.89,1; 3 -1.89,0.6; 4 -1.89,0.2; 5 -1.89,-0.2; 6 -1.89,-0.6; 7 -1.89,-1; 18 1.9,-1; 19 1.9,-0.6; 20 1.9,-0.2; 21 1.9,0.2; 22 1.9,0.6; 23 1.9,1 | smd 0.22 x 0.6: 9 -1.41,-1.95; 16 1.4,-1.95; 25 1.41,1.95; 32 -1.4,1.95 | smd 0.22 x 0.7: 10 -1,-1.9; 11 -0.6,-1.9; 12 -0.2,-1.9; 13 0.2,-1.9; 14 0.6,-1.9; 15 1,-1.9; 26 1,1.9; 27 0.6,1.9; 28 0.2,1.9; 29 -0.2,1.9; 30 -0.6,1.9; 31 -1,1.9 | smd 2.45 x 2.45: EXP 0,0
QFN35P500X500X90-49N = smd 0.81 x 0.2: 1 -2.445,2.275; 2 -2.445,1.925; 3 -2.445,1.575; 4 -2.445,1.225; 5 -2.445,0.875; 6 -2.445,0.525; 7 -2.445,0.175; 8 -2.445,-0.175; 9 -2.445,-0.525; 10 -2.445,-0.875; 11 -2.445,-1.225; 12 -2.445,-1.575; 13 -2.445,-1.925; 14 -2.445,-2.275; 25 2.445,-2.275; 26 2.445,-1.925; 27 2.445,-1.575; 28 2.445,-1.225; 29 2.445,-0.875; 30 2.445,-0.525; 31 2.445,-0.175; 32 2.445,0.175; 33 2.445,0.525; 34 2.445,0.875; 35 2.445,1.225; 36 2.445,1.575; 37 2.445,1.925; 38 2.445,2.275 | smd 0.2 x 0.81: 15 -1.575,-2.445; 16 -1.225,-2.445; 17 -0.875,-2.445; 18 -0.525,-2.445; 19 -0.175,-2.445; 20 0.175,-2.445; 21 0.525,-2.445; 22 0.875,-2.445; 23 1.225,-2.445; 24 1.575,-2.445; 39 1.575,2.445; 40 1.225,2.445; 41 0.875,2.445; 42 0.525,2.445; 43 0.175,2.445; 44 -0.175,2.445; 45 -0.525,2.445; 46 -0.875,2.445; 47 -1.225,2.445; 48 -1.575,2.445 | smd 3.7 x 3.7: 49 0,0
SON127P600X500X80-9N = smd 1.04 x 0.44: 1 -2.845,1.905; 2 -2.845,0.635; 3 -2.845,-0.635; 4 -2.845,-1.905; 5 2.845,-1.905; 6 2.845,-0.635; 7 2.845,0.635; 8 2.845,1.905 | smd 3.4 x 4.3: 9 0,0
SO8 = smd 0.6 x 2.2: 1 -1.905,-2.6; 2 -0.635,-2.6; 3 0.635,-2.6; 4 1.905,-2.6; 5 1.905,2.6; 6 0.635,2.6; 7 -0.635,2.6; 8 -1.905,2.6
SOT23-5 = smd 0.55 x 1: 1 -0.95,-1.3; 2 0,-1.3; 3 0.95,-1.3; 4 0.95,1.3; 5 -0.95,1.3
CRYSTAL-3225 = smd 1.5 x 1.2: 1 -1.2,-0.85; 2 1.2,-0.85; 3 1.2,0.85; 4 -1.2,0.85

### Placement (x,y rotation side)
C1  12.06,2.54 270 top
C2  10.16,2.54 270 top
C3  8.26,5.08 180 top
C4  8.89,6.99 0 top
C5  5.71,6.99 270 top
C6  3.81,6.35 270 top
C7  1.91,17.14 0 top
C8  6.99,16.51 90 top
C9  5.08,16.51 90 top
C10  11.43,15.88 0 top
C11  11.43,8.26 180 top
C12  16.51,20.95 90 top
C13  18.41,20.95 90 top
C14  20.32,20.95 90 top
C15  25.4,15.24 0 top
C16  22.23,20.95 90 top
C17  25.4,13.59 0 top
C18  16.51,10.79 180 top
C19  25.4,11.81 0 top
C20  13.97,16.51 180 top
C21  25.4,17.14 0 top
C22  29.21,19.05 0 top
C23  29.21,12.7 180 top
C24  12.7,22.86 90 top
C25  30.48,25.4 90 top
C26  23.5,25.4 90 top
C27  30.48,21.59 90 top
C28  24.13,21.59 90 top
C29  6.99,34.92 180 top
C30  6.35,27.94 270 top
C31  25.4,32.38 0 top
C32  30.48,32.38 90 top
C33  8.26,27.94 270 top
C34  21.59,23.5 180 top
C35  22.86,31.75 90 top
CON1  15.88,6.35 270 bottom
J1  15.88,30.48 0 top
L1  6.99,2.54 180 top
LED1  6.99,25.4 270 top
LED2  2.54,25.4 270 top
LED3  2.54,31.75 0 top
PB1  29.21,8.89 90 top
Q1  10.16,19.68 0 top
Q2  29.84,29.21 0 top
R1  13.34,5.71 270 top
R2  1.91,19.05 180 top
R3  11.43,5.71 90 top
R4  1.91,8.26 180 top
R5  1.91,10.16 180 top
R6  1.91,12.06 180 top
R7  1.91,13.97 180 top
R8  5.71,22.86 270 top
R9  8.26,22.86 270 top
R10  3.81,22.86 270 top
R11  1.27,22.86 270 top
R12  17.78,23.5 0 top
R13  10.79,22.86 90 top
R14  22.86,10.79 270 top
R15  14.61,13.34 180 top
R16  25.4,10.03 180 top
R17  25.4,19.05 0 top
R18  1.27,27.94 90 top
R19  3.81,27.94 90 top
R20  7.62,19.68 90 top
R21  12.7,19.68 270 top
R22  5.71,19.68 90 top
R23  27.3,29.21 270 top
R24  28.57,31.75 180 top
R25  24.77,29.84 0 top
R26  24.77,27.94 0 top
R27  20.57,5.08 270 top
U1  6.35,12.06 180 top
U2  19.68,15.24 270 top
U3  24.13,5.08 270 top
U4  17.14,4.45 180 top
U5  27.3,25.4 90 top
U6  27.3,21.59 90 top
U7  6.99,31.75 180 top
U8  24.77,35.56 0 top
XTAL1  11.43,12.06 270 top
XTAL2  29.21,15.88 90 top

### Tracks (layer width: path | path; a pad name or v marks a point on that pad's centre or on a via)
+3V3  (via drill 0.3)
  Top 0.203: LED1.A 5.71,24.88 R8.1 5.73,23.5 | U2.3 21.26,18.54 | 21.26,18.54 21.26,19.38 21.25,19.38 C14.1 | U2.4 20.91,18.54 21.26,18.54 | 6.15,15.86 6.1,15.86 | U1.13 6.15,14.55 5.46,15.24 5.46,15.48 5.08,15.86 | U2.19 15.71,15.41 C20.1 | C19.1 23.73,10.79 22.28,10.79 22.2,10.87 22.2,11.73 21.61,12.32 U2.37 | U2.46 22.97,16.11 v23.24,16.38 | U2.43 24.57,15.06 C15.1 | U2.1 21.96,19.29 22.23,19.56 C16.1
  Top 0.305: U7.3 6.04,32.19 6.22,32 7.62,32 7.93,32.32 U7.1 | U6.1 27.75,20.64 27.43,20.95 27.43,22.23 27.75,22.54 U6.3 | U5.1 27.75,24.45 27.43,24.77 27.43,26.04 27.75,26.35 U5.3
  Top 0.406: U7.1 7.93,34.62 C29.1 7.63,36.05 v7.62,36.07 | C25.1 29.7,24.75 v29.59,24.64 29.4,24.45 U5.1 | U6.1 29.4,20.64 v29.59,20.83 29.7,20.94 C27.1 | C14.1 C13.1 16.71,20.3 C12.1 16.42,20.19 v15.37,20.19 | C1.1 11.52,3.94 v11.05,3.94 10.41,3.94 10.16,3.68 C2.1 8.48,3.19 L1.1 | C1.1 12.29,3.39 | R7.2 1.27,13.96 v1.27,13.08 1.27,12.08 R6.2 R5.2 | C8.1 6.1,15.86 5.08,15.86 C9.1 4.74,16 v3.94,16 | R1.2 13.34,4.66 C1.1 | C20.1 14.62,17.38 v14.61,17.4 | 5.73,23.5 v6.73,23.5 | v9.78,23.5 10.78,23.5 R13.2 | C16.1 23,20.3 v23.24,20.07
  Bottom 0.203: v23.24,16.38 23.24,16 v24.77,14.48
  Bottom 0.254: CON1.P$9 CON1.P$8
  other vias: 24.77,12.7 24.77,10.92
  pour Bottom (isolate 0.203, no thermals): 0,0 31.75,0 31.75,38.1 0,38.1
  pour Top (no thermals): 24.51,15.62 24.51,9.65 25.02,9.65 25.02,15.62
CLKO_50M
  Top 0.203: U1.14 5.75,14.44 5.46,14.73 3.68,14.73 3.3,15.11 3.3,18.41 3.94,19.05 R22.1 6.46,18.29 8.38,18.29 8.64,18.03 8.64,15.49 7.87,14.73 7.49,14.73 7.35,14.59 U1.10
DTRN  (via drill 0.3)
  Top 0.203: R20.1 9.36,19.04 Q1.1 9.51,17.92 9.91,17.53 v12.19,17.53
  Route2 0.203: v14.22,10.92 14.22,13.08 13.08,14.22 13.08,16.64 v12.19,17.53
  Bottom 0.203: CON1.P$5 16.12,9.02 v14.22,10.92
ETH_RD+  (via drill 0.3)
  Top 0.203: U1.27 5.75,9.05 v5.46,8.76
  Bottom 0.203: CON1.P$14 15.12,5.45 14.73,5.84 7.37,5.84 5.46,7.75 v5.46,8.76
ETH_RD-  (via drill 0.3)
  Top 0.203: U1.26 5.35,9.41 5.21,9.27 v4.57,9.27
  Bottom 0.203: CON1.P$15 14.62,5.31 14.48,5.46 7.11,5.46 4.57,8 v4.57,9.27
ETH_TD+  (via drill 0.3)
  Top 0.203: U1.30 6.95,9.18 v7.62,8.51
  Bottom 0.203: CON1.P$2 14.62,7.39 14.48,7.24 8.26,7.24 7.62,7.87 v7.62,8.51
ETH_TD-  (via drill 0.3)
  Top 0.203: U1.29 6.55,8.94 6.99,8.51 v6.99,7.87
  Bottom 0.203: v6.99,7.87 8,6.86 14.73,6.86 15.13,7.26 15.13,8.14 CON1.P$3
GND  (via drill 0.3)
  Top 0.203: R10.1 3.81,24.88 LED2.C
  Top 0.406: U7.2 v6.99,34.04 6.33,34.69 C29.2 | LED3.3 v2.54,31.75 | v29.46,33.02 30.46,33.02 C32.2 | v26.92,32.38 C31.2 26.05,34.62 U8.2 | R23.1 27.32,29.84 v28.45,29.84 29.08,29.21 30.61,29.21 30.8,29.02 Q2.2 | U5.2 29.08,25.4 29.73,26.05 C25.2 v30.48,27.05 | U6.2 29.08,21.59 29.73,22.24 C27.2 v30.48,23.11 | XTAL2.2 29.86,17.27 C22.2 v30.73,19.05 | v26.8,12.7 C23.2 28.56,14.47 XTAL2.4 | C21.2 26.05,18.15 v26.04,18.16 26.04,19.04 R17.2 | v10.16,1.02 C2.2 | v1.27,7.24 1.27,8.24 R4.2 | v13.08,1.65 12.1,1.65 C1.2 | v10.41,4.83 11.19,4.83 R3.1 | v2.79,23.5 3.79,23.5 R10.1 | C3.2 6.1,5.08 v5.71,5.46 | v5.71,5.46 C5.2 | C6.2 5.68,5.5 v5.71,5.46 | v9.53,8 9.53,7 C4.2 | C11.2 10.79,8.27 v10.79,9.27 10.79,10.65 XTAL1.2 | C10.2 12.19,15.76 v12.19,14.73 12.19,13.35 XTAL1.4 | R2.1 C7.2 2.54,17.13 v2.54,16.13 | v3.94,17.27 4.99,17.27 C9.2 5.28,17.16 C8.2 | R15.2 v13.97,14.99 13.32,15.64 C20.2 | U3.4 22.23,6.6 v22.35,6.48 | U4.4 15.24,8.89 14.61,9.53 v13.59,9.53 14.86,9.53 15.86,10.53 C18.2 | v22.35,3.68 22.73,3.68 U3.9 | C33.2 8.24,27.3 v7.37,27.3 6.37,27.3 C30.2 | v30.35,6.1 30.35,7.18 PB1.3 PB1.4
  Bottom 0.254: CON1.P$7 17.12,9.76 v17.14,9.78
  Bottom 0.305: CON1.P$16 14.12,3.46 v14.1,3.43 15.11,3.43 15.62,3.93 CON1.P$13 | CON1.P$10 17.12,3.45 v17.14,3.43 | CON1.P$1 14.12,8.99 v13.59,9.53 14.86,9.53 15.62,8.76 CON1.P$4
  other vias: 10.54,36.83 11.81,36.83 13.08,36.83 14.35,36.83 15.62,36.83 16.89,36.83 18.16,36.83 19.43,36.83 20.7,36.83 11.68,34.67 11.68,26.29 18.29,30.99 21.97,35.56 26.8,14.35 12.95,30.48 6.35,12.06 19.68,15.24 19.68,16.76 19.68,13.72 18.16,15.24 21.21,15.24 25.91,3.68 25.91,6.48 23.11,22.35 17.53,21.72 19.56,22.35 10.54,24.64 20.95,24.51 23.11,27.69 15.88,30.48
  pour Route2: 0,0 31.75,0 31.75,38.1 0,38.1
  pour Route15: 0,0 31.75,0 31.75,38.1 0,38.1
  pour Top: 9.91,23.11 24.51,23.11 24.51,37.34 9.91,37.34
  pour Top (no thermals): 25.78,15.62 25.78,11.43 27.43,11.43 27.43,15.62
  pour Top (no thermals): 21.84,21.34 23.11,21.34 23.75,21.97 24.51,21.97 24.51,22.61 22.48,22.61 21.84,21.97
  pour Top (no thermals): 16.13,21.34 20.7,21.34 20.7,22.23 20.57,22.35 20.19,22.35 19.94,22.61 19.3,22.61 19.18,22.48 19.18,21.97 19.05,21.84 18.03,21.84 17.65,22.23 16.13,22.23
  pour Top (no thermals): 5.97,27.56 5.97,27.05 8.64,27.05 8.64,27.56
IO0_CLK_50  (via drill 0.3)
  Top 0.152: U2.23 16.81,14.02 15.88,13.08 15.88,12.83 15.62,12.57 13.46,12.57 13.21,12.83 13.21,15.11 12.7,15.62 12.7,16.51 12.57,16.64 10.03,16.64 v9.14,17.53 | R22.2 6.33,20.95 v8.76,20.95 9.22,20.5 Q1.6
  Bottom 0.152: v9.14,17.53 9.14,20.57 v8.76,20.95
IO1_TXD
  Top 0.152: U2.41 23.35,14.37 24,13.72 24,12.59 R14.1
IO2_BRD
  Top 0.152: U2.22 16.65,14.37 15.62,13.34 R15.1
IO3_RXD  (via drill 0.3)
  Top 0.152: U2.40 23.03,14.02 23.24,13.81 v23.24,13.72
  Route2 0.152: v23.24,13.72 23.75,13.21 23.75,11.18 24.38,10.54 24.38,6.99 22.61,5.21 20.19,5.21 v18.41,3.43
  Bottom 0.152: v18.41,3.43 17.78,2.79 17.02,2.79 16.64,3.17 16.64,4.56
  Bottom 0.203: 16.64,4.56 CON1.P$11
IO4_LEP_RST  (via drill 0.3)
  Top 0.152: R23.2 27.3,27.56 26.92,27.18 26.92,20.19 26.54,19.81 25.65,19.81 25.4,19.56 25.4,18.41 25.15,18.16 v24.77,18.16 | U2.24 16.97,13.66 16.26,12.95 16.26,12.7 15.62,12.06 v15.62,11.68
  Top 0.203: Q2.1 28.89,28.25 28.57,28.57 27.32,28.57 R23.2
  Route2 0.152: v15.62,11.68 15.62,13.59 18.16,16.13 21.84,16.13 23.88,18.16 v24.77,18.16
IO5_PHY_RSTN  (via drill 0.3)
  Top 0.152: v1.91,9.27 0.64,9.27 0.51,9.4 0.51,16.4 C7.1 | v8.89,9.02 7.79,10.12 | U2.34 20.56,11.39 20.98,10.97 20.98,10.3 21.35,9.93 v21.82,9.93
  Top 0.203: 7.75,10.16 U1.32 7.79,10.12 | C7.1 R2.2
  Route2 0.152: v8.89,9.02 9.53,9.02 9.91,8.64 14.73,8.64 16.36,10.26 17.8,10.26 18.14,9.93 v21.82,9.93
  Route15 0.152: v1.91,9.27 2.92,9.27 3.81,10.16 7.75,10.16 v8.89,9.02
IO12_SCLK  (via drill 0.3)
  Top 0.152: U2.18 15.86,15.77 15.37,16.26 v15.37,16.65 | v16.26,27.18 16.26,26.24 J1.13
  Route2 0.152: v15.37,16.65 15.37,18.8 14.48,19.68 14.48,20.83 16.26,22.61 v16.26,27.18
IO13_CSN  (via drill 0.3)
  Top 0.152: U2.20 15.95,15.06 v15.62,14.73 | v17.27,27.18 17.27,26.22 J1.14
  Route2 0.152: v15.62,14.73 17.02,16.13 17.02,22.1 17.27,22.35 v17.27,27.18
IO14_RED
  Top 0.152: U2.17 16.02,16.11 15.88,16.26 15.88,16.76 14.22,18.41 14.22,22.1 13.46,22.86 0.76,22.86 0.51,23.11 0.51,26.53 R18.1
IO15_GREEN  (via drill 0.3)
  Top 0.152: U2.21 16.49,14.71 15.88,14.1 14.99,14.1 14.73,14.35 14.73,15.11 13.97,15.88 13.97,17.27 13.84,17.4 13.84,21.59 v13.59,21.84 | v9.02,25.4 9.02,25.91 8.76,26.16 4.94,26.16 R19.1
  Route15 0.152: v13.59,21.84 9.53,21.84 9.02,22.35 v9.02,25.4
IO32_SDA  (via drill 0.3)
  Top 0.152: U2.12 18.11,18.34 17.78,18.67 15.62,18.67 14.86,19.43 14.86,20.7 15.11,20.95 v19.43,20.95
  Top 0.203: R25.1 24.11,31.51 v23.88,31.75 | v18.92,31.75 20.11,31.75 J1.22
  Route2 0.152: v19.43,20.95 20.19,21.72 20.19,30.48 v18.92,31.75
  Bottom 0.203: v23.88,31.75 v18.92,31.75
IO33_SCL  (via drill 0.3)
  Top 0.152: U2.13 17.76,18.18 17.65,18.29 15.49,18.29 14.61,19.18 14.61,21.84 15.37,22.61 17.65,22.61 17.91,22.35 v18.41,22.35
  Top 0.203: R26.1 24.11,27.95 23.11,28.96 v23.11,29.97 | v18.92,29.97 18.92,30.48 19.37,30.93 J1.21
  Route2 0.152: v18.41,22.35 18.41,29.46 v18.92,29.97
  Bottom 0.203: v23.11,29.97 v18.92,29.97
IO34_MISO  (via drill 0.3)
  Top 0.152: U2.10 18.81,19.04 v18.41,19.43 | J1.12 15.43,26.74 v14.99,27.18 14.53,26.72 J1.11
  Bottom 0.152: v18.41,19.43 18.41,19.68 14.99,23.11 v14.99,27.18
IO35_VSYNC  (via drill 0.3)
  Top 0.152: U2.11 18.46,18.5 v17.53,19.43 | v14.1,27.69 14.1,31.37 12.74,32.73 J1.2
  Bottom 0.152: v17.53,19.43 17.53,19.68 14.1,23.11 v14.1,27.69
IO36_BTN  (via drill 0.3)
  Top 0.152: v27.43,19.3 27.94,19.81 30.99,19.81 31.24,19.56 31.24,12.19 30.73,11.68 29.24,11.68 PB1.2 | U2.5 20.56,19.19 | R16.1 27.59,10.03 PB1.2 | PB1.1 PB1.2
  Top 0.203: 20.56,19.19 v20.57,19.3
  Bottom 0.152: v27.43,19.3 v20.57,19.3
IO39_MODE  (via drill 0.3)
  Top 0.152: U2.8 19.51,18.21 v19.94,18.67 | v22.99,18.16 23.86,18.16 R17.1
  Bottom 0.152: v19.94,18.67 20.45,18.16 v22.99,18.16
LEP_CLK_25M
  Top 0.203: U8.3 25.95,36.41 24.89,37.47 22.86,37.47 19.43,34.04 18.29,34.04 18.16,34.16 18.16,34.75 J1.26
LEP_RSTN  (via drill 0.3)
  Top 0.203: J1.24 19.15,33.63 v18.92,33.4 | Q2.3 29.84,31.1 | 29.84,31.1 C32.1 | 29.84,31.1 29.84,31.13 R24.1 29.23,32.12 v28.32,33.02
  Bottom 0.203: v18.92,33.4 27.94,33.4 v28.32,33.02
N$1
  Top 0.203: U1.31 7.35,9.67 8.26,8.76 8.26,7 C4.1
  Top 0.406: L1.2 6.13,3.6 6.48,3.94 7.96,3.94 C3.1 9.11,5.75 8.76,6.1 8.51,6.1 8.24,6.37 C4.1
N$2
  Top 0.203: U1.25 4.42,10.12 R4.1
N$3
  Top 0.203: U1.21 2.75,11.87 R6.1
N$4  (via drill 0.3)
  Top 0.203: U1.4 8.82,11.87 9.4,12.45 v9.4,12.83 | v13.21,12.06 13.21,10.03 12.83,9.65 12.83,6.87 R1.1
  Bottom 0.203: v9.4,12.83 12.45,12.83 v13.21,12.06
N$5
  Top 0.203: R3.2 10.53,6.37 10.16,6.73 10.16,9.4 8.89,10.67 U1.1 8.63,10.66 8.64,10.67
N$6
  Top 0.203: U1.20 3.48,12.27 2.56,13.19 R7.1
N$7  (via drill 0.3)
  Top 0.203: U1.11 6.95,14.82 7.24,15.11 7.62,15.11 8,15.49 v8,17.53 | R8.2 v7.11,22.21 R9.2
  Bottom 0.203: v8,17.53 8,21.32 v7.11,22.21
N$8  (via drill 0.3)
  Top 0.203: R11.2 R10.2 3.81,20.57 v4.7,19.68 | U1.12 6.55,15.06 6.48,15.13 v6.48,15.11
  Bottom 0.203: v4.7,19.68 4.7,16.89 v6.48,15.11
N$9
  Top 0.203: R11.1 1.27,24.88 LED2.A
N$10
  Top 0.203: R9.1 8.26,24.88 LED1.C
N$11
  Top 0.152: U2.44 23.67,15.41 24.26,16 28.96,16 30.06,14.9
  Top 0.203: 30.06,14.9 XTAL2.1 29.86,14.47 C23.1
N$12
  Top 0.152: U2.45 23.51,15.77 24.13,16.38 27.67,16.38 XTAL2.3
  Top 0.203: C22.1 28.56,17.27 XTAL2.3
N$13
  Top 0.203: R18.2 1.27,30.43 LED3.1
N$14  (via drill 0.3)
  Top 0.152: U2.9 19.16,19.41 v19.43,19.68
  Top 0.203: C24.1 11.81,22.21 | 11.81,22.21 R13.1 | Q1.3 11.01,18.89 v11.81,19.68 | v11.81,21.34 11.81,22.21
  Route15 0.152: v19.43,19.68 19.05,20.07 16.26,20.07 15.88,19.68 v11.81,19.68
  Bottom 0.203: v11.81,19.68 v11.81,21.34
N$15
  Top 0.203: U2.2 21.61,19.54 21.34,19.81 21.34,22.48 21.08,22.73 20.32,22.73 19.56,23.5 R12.2
N$16
  Top 0.203: U2.48 22.66,16.82 22.99,17.14 C21.1
N$17
  Top 0.203: R19.2 3.81,30.43 LED3.2
N$18
  Top 0.203: Q1.2 10.16,18.29 10.29,18.16 11.83,18.16 R21.2
N$21
  Top 0.203: R20.2 8.11,20.34 8.76,19.68 10.03,19.68 10.16,19.81 Q1.5
PHY_CRS_DV  (via drill 0.3)
  Top 0.152: U1.19 3.85,12.66 v3.3,13.21 | U2.16 16.55,16.46 v16.38,16.64
  Route15 0.152: v3.3,13.21 6.22,13.21 8.89,15.88 15.62,15.88 v16.38,16.64
PHY_MDC  (via drill 0.3)
  Top 0.152: U1.22 3.59,11.46 v3.3,11.18 | U2.36 21.26,11.96 v21.57,11.61
  Route15 0.152: v3.3,11.18 6.73,11.18 7.24,11.68 11.68,11.68 12.57,12.57 20.6,12.57 v21.57,11.61
PHY_MDIO  (via drill 0.3)
  Top 0.152: U2.35 20.91,11.47 v21.57,10.82
  Top 0.203: U1.23 4.08,11.06 3.17,10.16 R5.1 2.56,10.78 v2.16,11.18
  Route15 0.152: v2.16,11.18 2.79,10.54 6.99,10.54 7.24,10.79 13.08,10.79 14.48,12.19 20.19,12.19 v21.57,10.82
PHY_RXD0  (via drill 0.3)
  Top 0.152: U1.18 4.08,13.06 3.81,13.34 3.81,13.59 3.68,13.72 3.3,13.72 3.17,13.84 3.17,14.48 v2.54,15.11 | U2.14 16.61,17.68 v16.51,17.78
  Route15 0.152: v2.54,15.11 4.95,15.11 6.86,17.02 13.46,17.02 14.35,18.03 16.26,18.03 v16.51,17.78
PHY_RXD1  (via drill 0.3)
  Top 0.152: U1.17 4.41,13.88 v4.06,14.22 | U2.15 17.24,16.92 17.02,17.14 16.26,17.14 v15.88,17.53
  Route15 0.152: v15.88,17.53 15.49,17.53 14.35,16.38 8.64,16.38 6.48,14.22 v4.06,14.22
PHY_TX_EN  (via drill 0.3)
  Top 0.152: U2.42 23.77,14.71 v24,14.48 | U1.5 8.71,12.27 8.89,12.45 8.89,13.21 v9.4,13.72
  Route15 0.152: v24,14.48 21.59,14.48 21.46,14.61 17.53,14.61 17.14,14.22 13.59,14.22 12.45,15.37 v9.4,15.37
  Bottom 0.152: v9.4,13.72 v9.4,15.37
PHY_TXD0  (via drill 0.3)
  Top 0.152: U1.9 8.05,14.02 v8.26,14.22 | v22.61,12.32 22.61,12.57 22.48,12.7 22.05,12.7 U2.38
  Route15 0.152: v8.26,14.22 10.54,14.22 11.56,13.21 20.7,13.21 21.59,12.32 v22.61,12.32
PHY_TXD1  (via drill 0.3)
  Top 0.152: U2.39 22.28,13.66 v22.99,12.95 | U1.8 8.5,13.46 8.76,13.72 v8.76,14.86
  Route15 0.152: v8.76,14.86 10.92,14.86 12.06,13.72 18.03,13.72 18.54,14.22 20.7,14.22 21.97,12.95 v22.99,12.95
REGOUT
  Top 0.203: U1.28 6.15,8.69 5.71,8.26 C5.1
  Top 0.406: C6.1 5.28,7.2 C5.1
RTSN  (via drill 0.3)
  Top 0.203: Q1.4 12.54,20.5 R21.1 12.71,20.34 13.08,20.7 v13.08,21.34
  Route2 0.203: v14.99,10.92 14.99,16.13 13.34,17.78 v13.34,18.16
  Bottom 0.203: CON1.P$6 16.62,9.28 v14.99,10.92 | v13.34,18.16 13.34,21.08 v13.08,21.34
SD_CLK  (via drill 0.3)
  Top 0.152: v19.51,11.33 U2.31
  Top 0.203: U3.6 23.5,1.4 23.37,1.27 v22.86,1.27
  Route15 0.152: v22.86,1.27 22.86,2.41 22.99,2.54 22.99,7.98 20.98,9.98 20.98,11.02 20.68,11.33 v19.51,11.33
SD_CMD
  Top 0.152: U3.1 26.04,7.49 25.65,7.11 24.38,7.11 24.13,7.37 24.13,8.51 23.6,9.04 21.95,9.04 21.34,8.43 20.73,8.43 20.6,8.56 20.6,9.6 19.02,11.18 19.02,11.68 19.18,11.84 19.18,12.78 U2.30
SDI_SD1  (via drill 0.3)
  Top 0.152: U2.33 20.21,12.35 20.24,12.32 20.24,11.07 v20.5,10.82
  Top 0.203: U4.5 15.24,1.14 v14.48,1.14 | U3.5 22.23,2.16 v21.46,1.4
  Route15 0.203: v21.46,1.4 19.94,2.92 19.94,4.19 20.5,4.75 v20.5,10.82
  Bottom 0.203: v14.48,1.14 18.41,1.14 18.92,1.65 21.21,1.65 v21.46,1.4
SDO_SD0  (via drill 0.3)
  Top 0.152: U3.2 24.77,8.76 24.18,9.35 21.79,9.35 21.54,9.09 v21.11,9.09 21.11,9.53 19.96,10.67 19.96,11.79 19.86,11.89 U2.32 | U4.2 v17.78,9.02
  Route2 0.152: v17.78,9.02 17.78,8.13 17.91,8 20.02,8 v21.11,9.09
SHD_SD2  (via drill 0.3)
  Top 0.152: v19.81,9.27 18.16,10.92 18.16,11.73 18.46,12.03 U2.28 | U4.7 17.78,0.64 17.91,0.51 19.81,0.51 v20.07,0.76
  Top 0.203: U3.7 24.77,1.27 24,0.51 20.32,0.51 v20.07,0.76
  Route15 0.203: v20.07,0.76 19.43,0.76 19.05,1.14 19.05,4.06 19.81,4.83 v19.81,9.27
SRAM_CLK  (via drill 0.3)
  Top 0.152: v19.05,9.4 17.78,10.67 17.78,11.84 18.11,12.17 U2.27
  Top 0.203: U4.6 16.51,3.94 16.89,4.32 v18.29,4.32
  Route15 0.203: v19.05,9.4 19.05,5.08 v18.29,4.32
SRAM_CSN  (via drill 0.3)
  Top 0.203: v18.41,8.51 19.05,7.87 U4.1 19.05,6.35 19.67,5.73 R27.1 | v16.51,11.68 16.51,12.32 16.99,12.79 U2.25
  Route15 0.203: v18.41,8.51 17.4,8.51 16.51,9.4 v16.51,11.68
SWP_SD3
  Top 0.152: U3.3 23.06,7.92 22.73,8.26 22.73,8.53 22.61,8.66 21.97,8.66 21.46,8.15 | U2.29 18.8,12.78 18.8,11.89 18.54,11.63 18.54,11.2 20.32,9.42 20.32,8.41 20.57,8.15 21.46,8.15 | U4.3 16.51,5.21 16.64,5.08 21.21,5.08 21.46,5.33 21.46,8.15
TXD  (via drill 0.3)
  Top 0.152: v23.75,10.03 22.97,10.03 R14.2
  Route2 0.152: v23.75,10.03 23.75,9.14 20.95,6.35 16.13,6.35 15.88,6.1 v15.88,3.43
  Bottom 0.152: CON1.P$12 16.12,3.68 v15.88,3.43
VDD_2V8  (via drill 0.3)
  Top 0.406: U6.5 25.02,20.64 | 25.02,20.64 24.43,20.64 C28.1 | J1.19 19.35,29.13 v19.05,28.83 | C35.1 22.23,30.46 v22.23,29.08 | v25.02,23.11 25.02,20.64
  Bottom 0.406: v19.05,28.83 21.97,28.83 v22.23,29.08 22.23,25.91 v25.02,23.11
VDD_SDIO  (via drill 0.3)
  Top 0.203: U2.26 17.76,12.3 17.16,11.7 C18.1
  Top 0.254: U3.8 26.04,2.92 25.91,3.05 21.08,3.05 v20.57,3.56 | U4.8 19.05,2.67 19.94,3.56 v20.57,3.56 | C18.1 17.78,10.16 17.78,9.91 v18.29,9.4 | R27.2 v20.57,3.56
  Bottom 0.254: v20.57,3.56 20.57,7.11 v18.29,9.4
VDDC_1V2  (via drill 0.3)
  Top 0.406: U7.5 7.93,29.66 8.26,29.34 C33.1 | C30.1 C33.1 | J1.7 12.61,28.23 v12.95,28.57 | v9.4,28.57 8.27,28.57 C33.1
  Bottom 0.406: v12.95,28.57 v9.4,28.57
VDDIO_3V0
  Top 0.203: J1.23 18.51,32.73 17.65,31.88 17.65,28.7 19.05,27.3 19.05,26.2 J1.16 | R24.2 26.7,31.75 25.41,30.46
  Top 0.406: J1.16 20.18,26.17 22.24,24.11 C34.1 22.86,23.5 23.5,24.13 C26.1 23.59,24.45 24.77,24.45 | U5.5 24.77,24.45 | 24.77,24.45 24.77,26.67 25.41,27.32 R26.2 R25.2 25.41,30.46 24.77,31.11 24.77,32.37 C31.1 24.75,33.52 U8.1 U8.4
XI
  Top 0.152: U1.2 9.08,11.06 9.96,11.94 11.56,11.94 12.28,11.21 XTAL1.3
  Top 0.203: C11.1 12.08,10.66 XTAL1.3
XO
  Top 0.152: U1.3 8.98,11.46 10.54,13.01 10.54,13.27
  Top 0.203: 10.54,13.27 XTAL1.1 10.78,13.46 C10.1

### Text on the board
tPlace: A | A
bPlace: tCam-Eth | Rev 1 | (c) 2023 danjuliodesigns, LLC